# EAGLE design GSM Adapter (EAGLE 5.10)
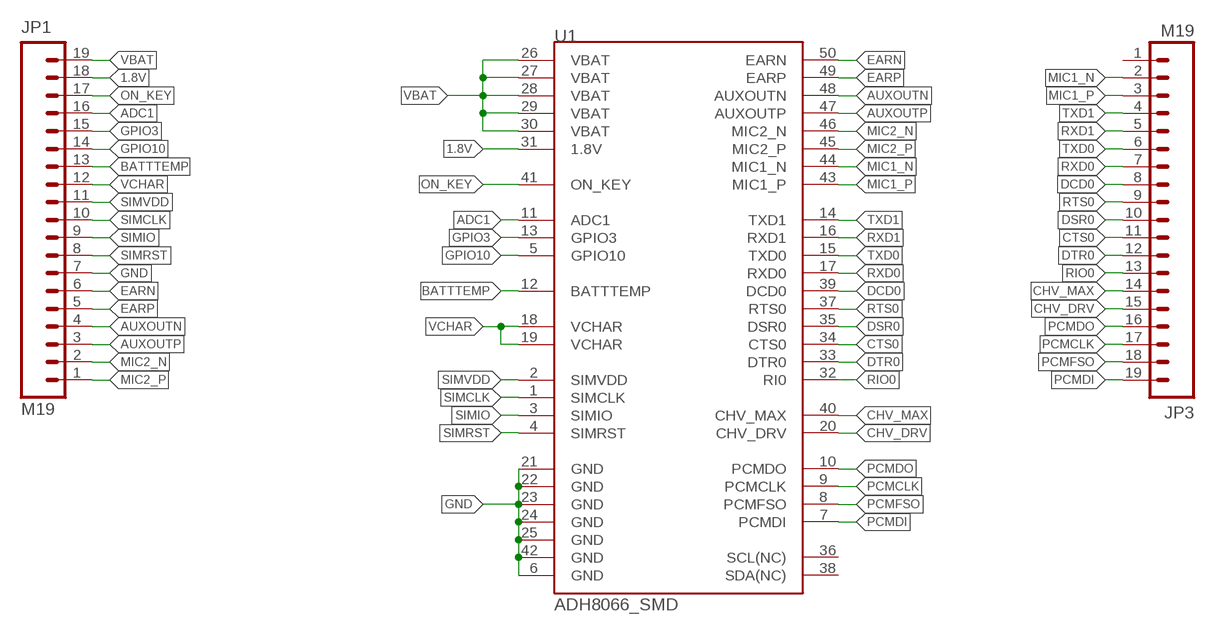
[diagram p0: schematic, sheet 1]

## Parts
JP1  M19  [1X19]
JP3  M19  [1X19]
U1  ADH8066_SMD  [ADH8066]

## Nets
1.8V: JP1.18 U1.31(1.8V)
ADC1: JP1.16 U1.11(ADC1)
AUXOUTN: JP1.4 U1.48(AUXOUTN)
AUXOUTP: JP1.3 U1.47(AUXOUTP)
BATTTEMP: JP1.13 U1.12(BATTTEMP)
CHV_DRV: JP3.15 U1.20(CHV_DRV)
CHV_MAX: JP3.14 U1.40(CHV_MAX)
CTS0: JP3.11 U1.34(CTS0)
DCD0: JP3.8 U1.39(DCD0)
DSR0: JP3.10 U1.35(DSR0)
DTR0: JP3.12 U1.33(DTR0)
EARN: JP1.6 U1.50(EARN)
EARP: JP1.5 U1.49(EARP)
GND: JP1.7 U1.6(GND) U1.21(GND) U1.22(GND) U1.23(GND) U1.24(GND) U1.25(GND) U1.42(GND)
GPIO3: JP1.15 U1.13(GPIO3)
GPIO10: JP1.14 U1.5(GPIO10)
MIC1_N: JP3.2 U1.44(MIC1_N)
MIC1_P: JP3.3 U1.43(MIC1_P)
MIC2_N: JP1.2 U1.46(MIC2_N)
MIC2_P: JP1.1 U1.45(MIC2_P)
ON_KEY: JP1.17 U1.41(ON_KEY)
PCMCLK: JP3.17 U1.9(PCMCLK)
PCMDI: JP3.19 U1.7(PCMDI)
PCMDO: JP3.16 U1.10(PCMDO)
PCMFSO: JP3.18 U1.8(PCMFSO)
RIO0: JP3.13 U1.32(RI0)
RTS0: JP3.9 U1.37(RTS0)
RXD0: JP3.7 U1.17(RXD0)
RXD1: JP3.5 U1.16(RXD1)
SIMCLK: JP1.10 U1.1(SIMCLK)
SIMIO: JP1.9 U1.3(SIMIO)
SIMRST: JP1.8 U1.4(SIMRST)
SIMVDD: JP1.11 U1.2(SIMVDD)
TXD0: JP3.6 U1.15(TXD0)
TXD1: JP3.4 U1.14(TXD1)
VBAT: JP1.19 U1.26(VBAT) U1.27(VBAT) U1.28(VBAT) U1.29(VBAT) U1.30(VBAT)
VCHAR: JP1.12 U1.18(VCHAR) U1.19(VCHAR)
Unconnected: JP3.1 U1.36(SCL(NC)) U1.38(SDA(NC))

## Library data of the parts
JP1 JP3 = SparkFun:M19
U1 = SparkFun:ADH8066: 8066-GSM-GPRS module from ADH-Tech

## Board
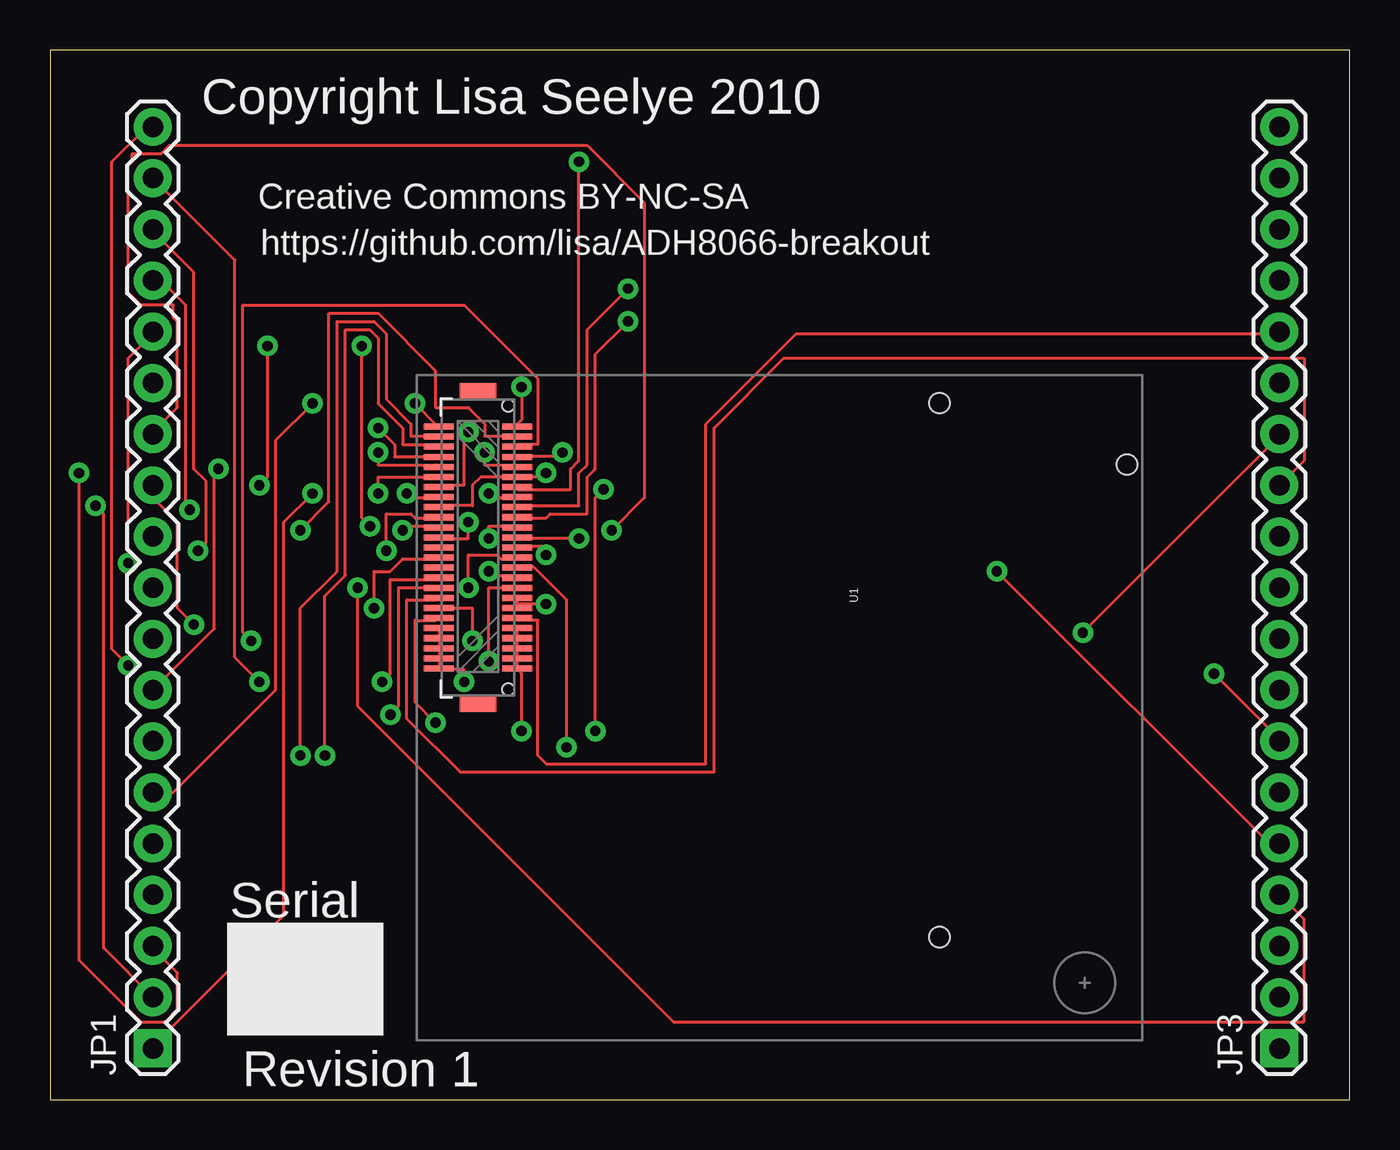
[diagram p1: board, top side]
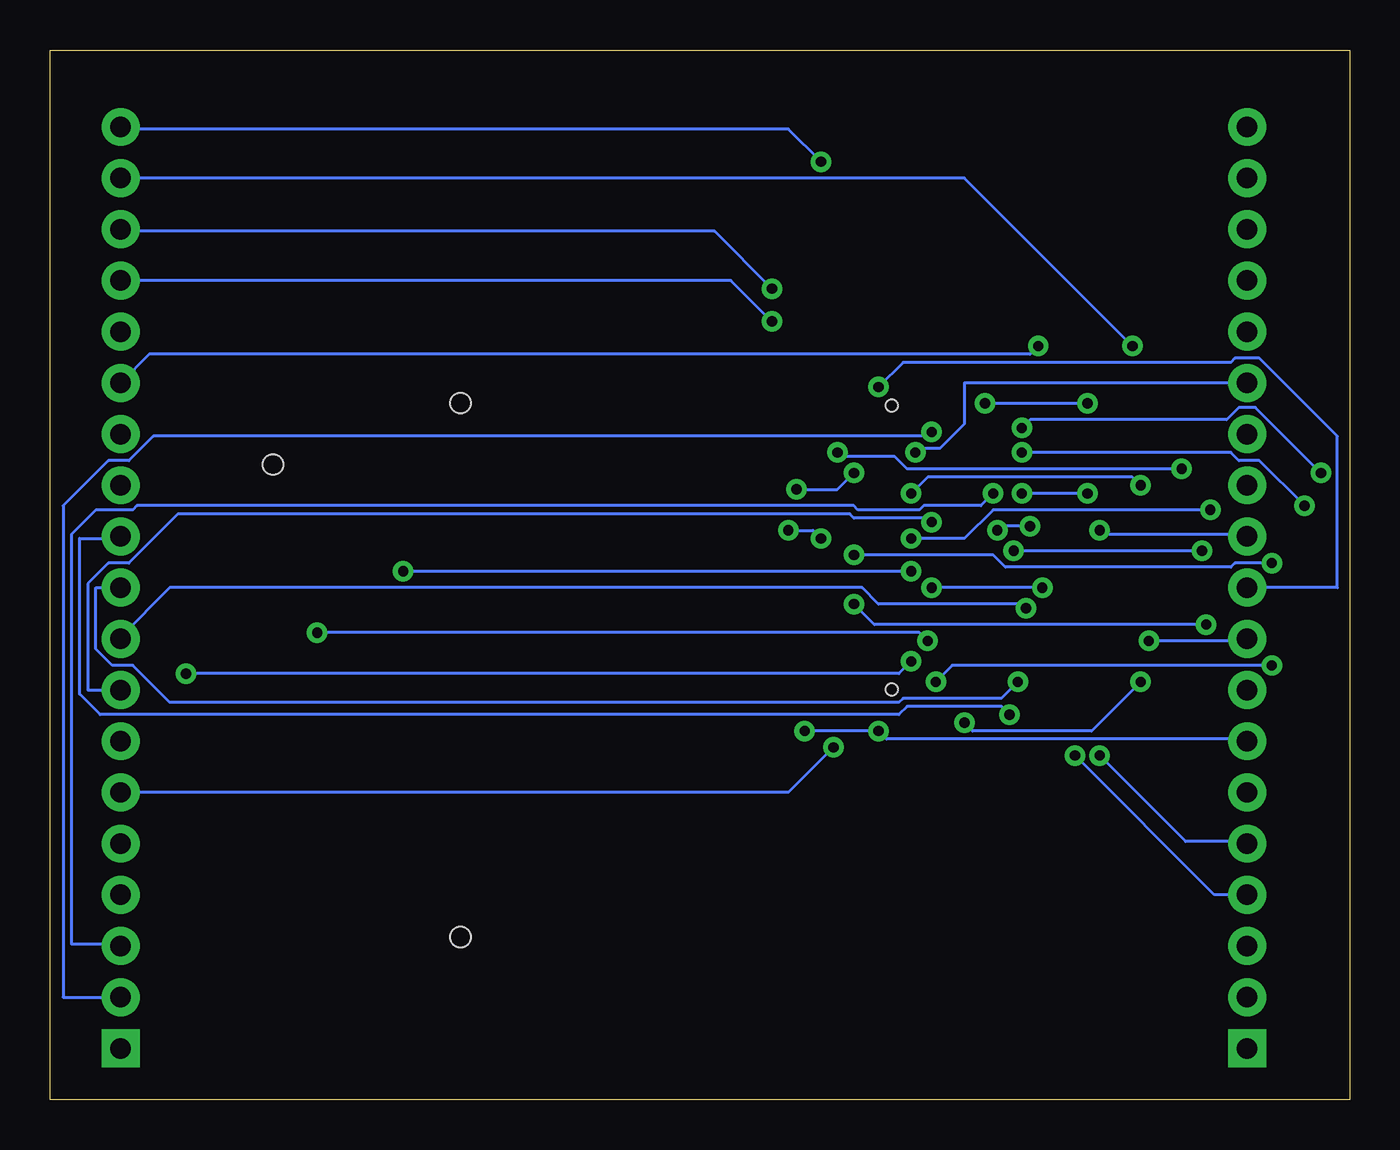
[diagram p2: board, bottom side, seen from below]

Size 64.44 x 52.06 mm. Coordinates in mm from the lower left corner, seen from the top.
Outline: 0,0 64.44,0 64.44,52.06 0,52.06 0,0
Copper layers (1*16): Top 0.035mm / dielectric 1.5mm / Bottom 0.035mm
Design rules "laenpcb": minimum track width 6mil, minimum drill 20mil, track to track 6mil, track to pad 6mil, pad to pad 6mil, via to via 6mil, smd to smd 6mil, copper to edge 10mil, drill to drill 6mil, minimum pad ring 12mil, minimum via ring 10mil, stop-mask expansion 4mil, vias tented up to drill 25mil, thermal gap 10mil

### Footprints (pad centres in the part's own frame; a part is rotated, then mirrored left to right if it is on the bottom)
1X19 = drill 1.016 pad 1.88 square: 1 0,0 | drill 1.016 pad 1.88 round: 2 2.54,0; 3 5.08,0; 4 7.62,0; 5 10.16,0; 6 12.7,0; 7 15.24,0; 8 17.78,0; 9 20.32,0; 10 22.86,0; 11 25.4,0; 12 27.94,0; 13 30.48,0; 14 33.02,0; 15 35.56,0; 16 38.1,0; 17 40.64,0; 18 43.18,0; 19 45.72,0
ADH8066 = smd 0.3 x 1.5: 1 2.55,5; 2 3.05,5; 3 3.55,5; 4 4.05,5; 5 4.55,5; 6 5.05,5; 7 5.55,5; 8 6.05,5; 9 6.55,5; 10 7.05,5; 11 7.55,5; 12 8.05,5; 13 8.55,5; 14 9.05,5; 15 9.55,5; 16 10.05,5; 17 10.55,5; 18 11.05,5; 19 11.55,5; 20 12.05,5; 21 12.55,5; 22 13.05,5; 23 13.55,5; 24 14.05,5; 25 14.55,5; 26 14.55,1.1; 27 14.05,1.1; 28 13.55,1.1; 29 13.05,1.1; 30 12.55,1.1; 31 12.05,1.1; 32 11.55,1.1; 33 11.05,1.1; 34 10.55,1.1; 35 10.05,1.1; 36 9.55,1.1; 37 9.05,1.1; 38 8.55,1.1; 39 8.05,1.1; 40 7.55,1.1; 41 7.05,1.1; 42 6.55,1.1; 43 6.05,1.1; 44 5.55,1.1; 45 5.05,1.1; 46 4.55,1.1; 47 4.05,1.1; 48 3.55,1.1; 49 3.05,1.1; 50 2.55,1.1 | smd 0.8 x 1.8: NC@1 0.8,3.05; NC@2 16.3,3.05 | hole 0.6: 15.6,4.55; 1.5,4.55 | hole 1: 4.43,35.24; 1.38,25.94; 27.88,25.94

### Placement (x,y rotation side)
JP1  5.08,2.54 90 top
JP3  60.96,2.54 90 top
U1  18.16,35.94 270 top

### Tracks (layer width: path | path; a pad name or v marks a point on that pad's centre or on a via)
1.8V  (via drill 0.51)
  Top 0.152: v19.1,18.69 18.09,19.71 18.09,23.77 19.1,23.77 U1.31 | v10.36,20.73 9.14,21.95 9.14,41.66 JP1.18
  Bottom 0.152: v19.1,18.69 18.69,18.29 12.8,18.29 v10.36,20.73
ADC1  (via drill 0.51)
  Top 0.152: v21.74,27.84 21.74,28.45 22.96,28.45 U1.11 | v6.91,29.26 6.71,29.46 6.71,39.42 5.49,40.64 JP1.16
  Bottom 0.152: v21.74,27.84 19.1,27.84 17.68,29.26 v6.91,29.26
AUXOUTN  (via drill 0.51)
  Top 0.152: v13.61,17.07 13.61,24.99 14.63,26.01 14.63,38.2 15.85,38.2 16.26,37.8 16.26,34.54 17.48,33.33 17.48,32.51 19.1,32.51 U1.48
  Bottom 0.152: v13.61,17.07 6.71,10.16 JP1.4
AUXOUTP  (via drill 0.51)
  Top 0.152: v16.26,33.33 17.07,32.51 17.07,31.9 19.1,31.9 U1.47 | v1.42,31.09 1.42,6.91 4.47,3.86 5.69,3.86 6.3,4.47 6.3,6.3 5.08,7.52 JP1.3
  Bottom 0.152: v16.26,33.33 15.85,33.73 6.1,33.73 5.49,34.34 4.67,34.34 v1.42,31.09
BATTTEMP  (via drill 0.51)
  Top 0.152: v26.21,27.84 23.16,27.84 U1.12 | v27.84,28.25 29.46,29.87 29.46,44.5 26.62,47.35 5.89,47.35 5.49,46.94 4.06,46.94 4.06,46.53 3.86,46.33 3.86,40.03 4.47,39.42 6.1,39.42 6.1,38.81 6.3,38.61 6.3,34.34 5.08,33.12 JP1.13
  Bottom 0.152: v26.21,27.84 26.62,28.25 v27.84,28.25
CHV_DRV
  Top 0.152: U1.20 23.16,23.77 24.18,23.77 24.18,17.07 24.59,16.66 32.51,16.66 32.51,33.53 36.98,38 60.96,38 JP3.15
CHV_MAX  (via drill 0.51)
  Top 0.152: v17.48,28.25 17.48,28.45 19.1,28.45 U1.40 | v15.85,28.45 15.44,28.85 v15.44,37.39
  Bottom 0.152: v17.48,28.25 17.27,28.45 v15.85,28.45 | v15.44,37.39 15.85,36.98 59.54,36.98 JP3.14
CTS0  (via drill 0.51)
  Top 0.152: v16.87,19.1 17.27,19.51 17.27,25.4 19.1,25.4 U1.34
  Bottom 0.152: v16.87,19.1 17.27,19.51 21.95,19.51 22.35,19.1 61.98,19.1 62.99,20.12 62.99,27.84 60.96,27.84 JP3.11
DCD0  (via drill 0.51)
  Top 0.152: v20.73,28.65 20.73,27.84 19.3,27.84 U1.39
  Bottom 0.152: v20.73,28.65 20.93,28.85 24.59,28.85 24.79,29.06 58.12,29.06 60.55,26.62 61.57,26.62 62.59,25.6 62.59,20.32 JP3.8
DSR0  (via drill 0.51)
  Top 0.152: v16.46,20.73 16.87,21.13 16.87,25.81 19.1,25.81 U1.35
  Bottom 0.152: v16.46,20.73 17.27,19.91 22.15,19.91 22.35,19.71 58.52,19.71 60.35,21.54 61.37,21.54 62.18,22.35 62.18,25.4 JP3.10
DTR0
  Top 0.152: JP3.12 62.18,31.7 62.18,36.78 36.37,36.78 32.92,33.33 32.92,16.26 20.32,16.26 17.68,18.9 17.68,24.79 19.1,24.79 U1.33
EARN  (via drill 0.51)
  Top 0.152: v18.09,34.54 19.1,33.53 U1.50 | v13.01,34.54 11.18,32.72 11.18,20.32 6.1,15.24 JP1.6
  Bottom 0.152: v13.01,34.54 v18.09,34.54
EARP  (via drill 0.51)
  Top 0.152: v12.39,17.07 12.39,24.38 14.22,26.21 14.22,38.61 16.05,38.61 16.66,38 16.66,34.75 17.88,33.53 17.88,32.92 19.1,32.92 U1.49
  Bottom 0.152: v12.39,17.07 8.13,12.8 5.08,12.8 JP1.5
GND  (via drill 0.51)
  Top 0.152: U1.42 19.3,29.46 20.93,29.46 20.93,30.48 21.34,30.89 22.96,30.89 U1.6 24.59,30.89 v24.59,31.09 | 23.16,22.35 23.16,22.76 U1.22 23.16,22.96 23.16,23.37 U1.21 | 23.16,22.35 23.16,21.95 U1.24 23.16,21.74 23.16,21.54 U1.25 23.16,21.34 23.37,21.13 v23.37,18.29 | 23.16,22.35 U1.23 | v27.43,30.28 27.03,29.87 v27.03,18.29
  Bottom 0.152: JP1.7 5.08,17.88 22.96,17.88 v23.37,18.29 v27.03,18.29 | v24.59,31.09 25.4,30.28 v27.43,30.28
GPIO3  (via drill 0.51)
  Top 0.152: v24.59,27.03 24.59,27.43 23.16,27.43 U1.13 | v3.86,26.62 3.86,36.78 5.08,38 JP1.15
  Bottom 0.152: v24.59,27.03 17.68,27.03 17.07,26.42 5.89,26.42 5.69,26.62 v3.86,26.62
GPIO10  (via drill 0.51)
  Top 0.152: v21.54,32.11 21.54,31.5 22.96,31.5 U1.5
  Bottom 0.152: v21.54,32.11 21.34,32.31 20.32,32.31 19.1,33.53 19.1,35.56 JP1.14
MIC1_N  (via drill 0.51)
  Top 0.152: v20.73,33.12 20.52,32.92 20.52,30.48 19.3,30.48 U1.44
  Bottom 0.152: v20.73,33.12 20.93,32.92 59.33,32.92 60.55,31.7 61.57,31.7 63.8,29.46 63.8,5.08 JP3.2
MIC1_P  (via drill 0.51)
  Top 0.152: v17.68,30.07 17.68,29.87 19.1,29.87 U1.43
  Bottom 0.152: v17.68,30.07 18.29,29.46 21.13,29.46 21.34,29.26 24.38,29.26 24.59,29.46 60.15,29.46 60.35,29.26 62.18,29.26 63.4,28.04 63.4,7.72 60.96,7.72 JP3.3
MIC2_N  (via drill 0.51)
  Top 0.152: v16.26,32.11 16.26,31.5 19.1,31.5 U1.46 | v2.23,29.46 2.64,29.06 2.64,7.52 JP1.2
  Bottom 0.152: v16.26,32.11 5.89,32.11 5.49,31.7 4.47,31.7 v2.23,29.46
MIC2_P  (via drill 0.51)
  Top 0.152: v16.26,30.07 16.26,30.89 19.1,30.89 U1.45 | v13.01,30.07 11.58,28.65 11.58,9.14 5.08,2.64 JP1.1
  Bottom 0.152: v13.01,30.07 v16.26,30.07
ON_KEY  (via drill 0.51)
  Top 0.152: v16.66,27.23 16.66,29.06 17.88,29.06 18.09,28.85 19.1,28.85 U1.41 | v7.32,27.23 7.72,27.64 7.72,30.68 7.11,31.29 7.11,41.05 5.08,43.08 JP1.17
  Bottom 0.152: v7.32,27.23 v16.66,27.23
PCMCLK  (via drill 0.51)
  Top 0.152: v28.65,40.23 26.62,38.2 26.62,31.5 26.21,31.09 26.21,29.46 23.16,29.46 U1.9
  Bottom 0.152: v28.65,40.23 31.5,43.08 60.96,43.08 JP3.17
PCMDI  (via drill 0.51)
  Top 0.152: v26.21,46.53 26.21,31.7 25.81,31.29 25.81,30.28 23.16,30.28 U1.7
  Bottom 0.152: v26.21,46.53 27.84,48.16 60.96,48.16 JP3.19
PCMDO  (via drill 0.51)
  Top 0.152: v28.65,38.61 27.03,36.98 27.03,31.29 26.62,30.89 26.62,29.06 24.79,29.06 24.59,28.85 23.16,28.85 U1.10
  Bottom 0.152: v28.65,38.61 30.68,40.64 JP3.16
PCMFSO  (via drill 0.51)
  Top 0.152: v21.74,30.07 21.74,29.87 22.96,29.87 U1.8 | v10.36,30.48 10.77,30.89 v10.77,37.39
  Bottom 0.152: v21.74,30.07 20.93,30.89 10.77,30.89 v10.36,30.48 | v10.77,37.39 19.1,45.72 JP3.18
RIO0  (via drill 0.51)
  Top 0.152: v20.93,22.76 20.93,24.38 19.3,24.38 U1.32 | v51.21,23.16 60.96,32.92 JP3.13
  Bottom 0.152: v20.93,22.76 21.34,23.16 v51.21,23.16
RTS0  (via drill 0.51)
  Top 0.152: v16.05,24.38 16.05,26.21 16.87,26.21 17.48,26.82 19.1,26.82 U1.37
  Bottom 0.152: v16.05,24.38 16.26,24.59 23.37,24.59 24.18,25.4 58.52,25.4 60.96,22.96 JP3.9
RXD0  (via drill 0.51)
  Top 0.152: v21.74,21.74 21.74,25.4 22.96,25.4 U1.17 | v57.71,21.13 60.96,17.88 JP3.7
  Bottom 0.152: v21.74,21.74 22.35,21.13 v57.71,21.13
RXD1  (via drill 0.51)
  Top 0.152: v21.74,26.21 21.74,26.01 22.96,26.01 U1.16 | v46.94,26.21 60.35,12.8 60.96,12.8 JP3.5
  Bottom 0.152: v21.74,26.21 v46.94,26.21
SIMCLK  (via drill 0.51)
  Top 0.152: v23.37,35.36 23.37,33.73 23.16,33.53 U1.1
  Bottom 0.152: v23.37,35.36 22.15,36.58 5.89,36.58 5.69,36.78 4.47,36.78 0.61,32.92 0.61,25.4 JP1.10
SIMIO  (via drill 0.51)
  Top 0.152: v9.96,22.76 9.55,23.16 9.55,39.42 20.52,39.42 24.18,35.76 24.18,32.51 23.16,32.51 U1.3
  Bottom 0.152: v9.96,22.76 5.08,22.76 JP1.9
SIMRST  (via drill 0.51)
  Top 0.152: v25.4,32.11 25.4,31.9 23.16,31.9 U1.4 | v8.33,31.29 8.13,31.09 8.13,23.37 JP1.8
  Bottom 0.152: v25.4,32.11 25.2,31.9 22.55,31.9 21.95,31.29 v8.33,31.29
SIMVDD  (via drill 0.51)
  Top 0.152: v12.39,28.25 13.82,29.67 13.82,39.01 16.26,39.01 19.1,36.17 19.1,34.34 20.73,34.34 21.54,33.53 21.54,32.92 22.96,32.92 U1.2
  Bottom 0.152: v12.39,28.25 12.19,28.04 5.08,28.04 JP1.11
TXD0  (via drill 0.51)
  Top 0.152: v25.6,17.48 25.6,24.79 23.98,26.42 23.16,26.42 U1.15
  Bottom 0.152: v25.6,17.48 27.84,15.24 JP3.6
TXD1  (via drill 0.51)
  Top 0.152: v20.73,25.4 20.73,27.03 22.15,27.03 22.35,26.82 22.96,26.82 U1.14 | v15.24,25.4 15.24,19.51 30.89,3.86 62.18,3.86 62.18,8.94 JP3.4
  Bottom 0.152: v15.24,25.4 v20.73,25.4
VBAT  (via drill 0.51)
  Top 0.152: 19.3,22.35 19.3,22.76 U1.29 19.3,22.96 19.3,23.37 U1.30 | 19.3,22.35 19.3,21.95 U1.27 19.3,21.74 19.3,21.54 U1.26 19.3,21.34 20.52,21.34 v20.52,20.73 | 19.3,22.35 U1.28 | v3.86,21.54 3.05,22.35 3.05,46.53 4.67,48.16 5.08,48.16 JP1.19
  Bottom 0.152: v20.52,20.73 19.71,21.54 v3.86,21.54
VCHAR  (via drill 0.51)
  Top 0.152: 23.16,24.59 23.16,24.79 U1.18 | 23.16,24.59 U1.19 | v24.59,24.59 23.16,24.59 | v7.11,23.57 6.3,24.38 6.3,28.65 5.08,29.87 JP1.12
  Bottom 0.152: v24.59,24.59 23.57,23.57 v7.11,23.57

### Text on the board
tPlace: Copyright Lisa Seelye 2010 | Creative Commons BY-NC-SA | https://github.com/lisa/ADH8066-breakout | Serial | Revision 1